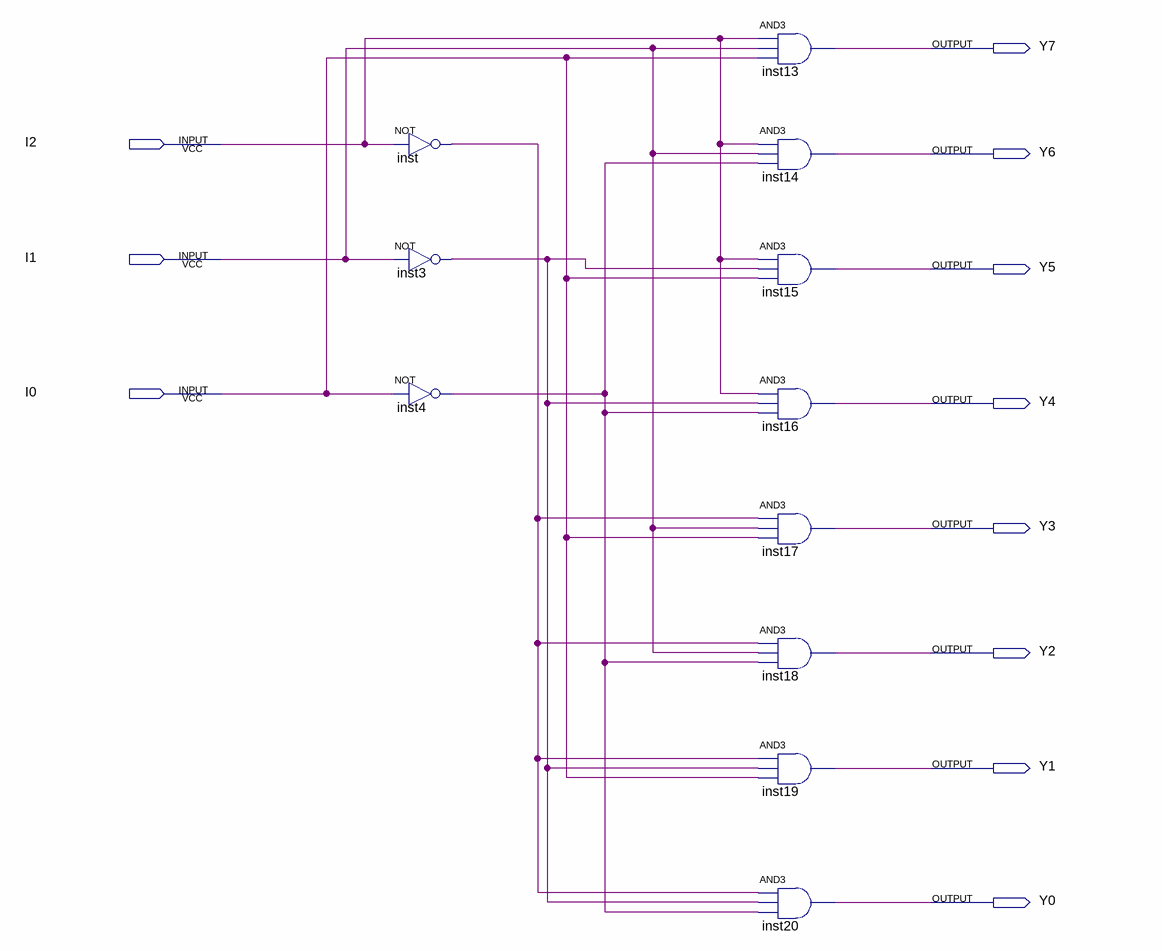
[diagram p0: schematic sheet]
// Quartus schematic my_38_decoder.bdf as structural Verilog: 11 symbols, 11 pins
module my_38_decoder (
  input  I2,
  input  I1,
  input  I0,
  output Y7,
  output Y6,
  output Y5,
  output Y4,
  output Y3,
  output Y2,
  output Y1,
  output Y0
);

  wire inst3_out, inst4_out, inst_out;

  not inst (inst_out, I2);
  not inst3 (inst3_out, I1);
  not inst4 (inst4_out, I0);
  and inst13 (Y7, I2, I1, I0);
  and inst14 (Y6, I2, I1, inst4_out);
  and inst15 (Y5, I2, inst3_out, I0);
  and inst16 (Y4, I2, inst3_out, inst4_out);
  and inst17 (Y3, inst_out, I1, I0);
  and inst18 (Y2, inst_out, I1, inst4_out);
  and inst19 (Y1, inst_out, inst3_out, I0);
  and inst20 (Y0, inst_out, inst3_out, inst4_out);
endmodule
